# EAGLE design strobe_ds (EAGLE 6.3)
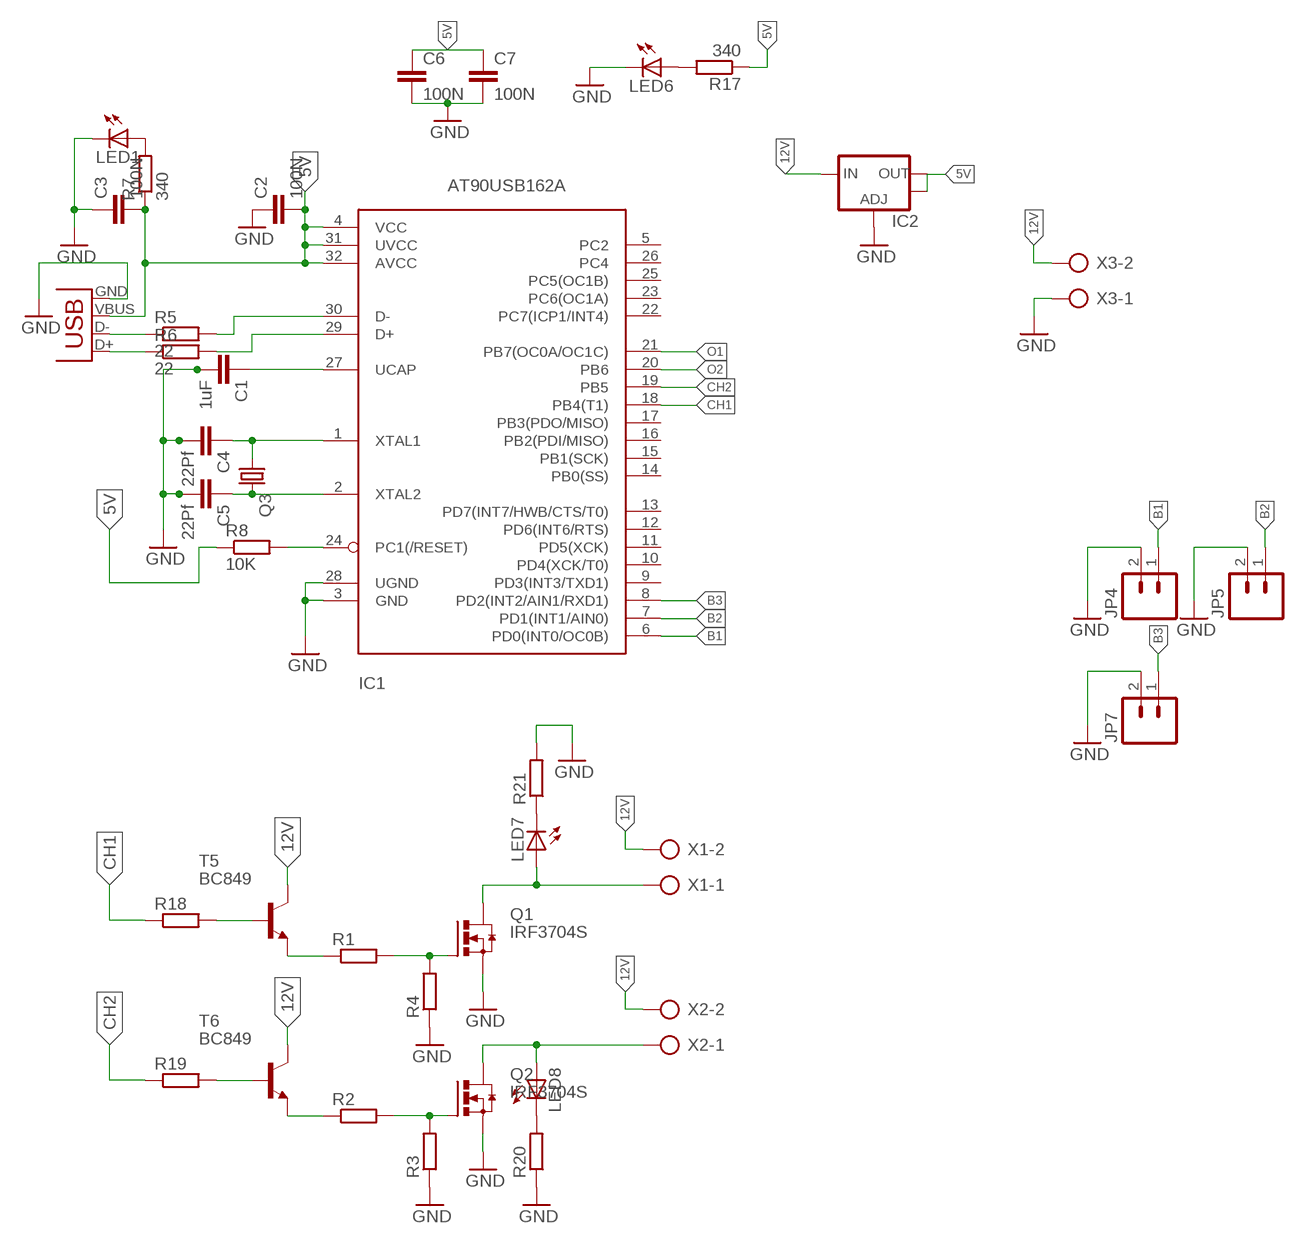
[diagram p0: schematic, sheet 1]

## Parts
C1  1uF  C-EUC0805  [C0805]
C2  100N  C-EUC0805  [C0805]
C3  100N  C-EUC0805  [C0805]
C4  22Pf  C-EUC0603  [C0603]
C5  22Pf  C-EUC0603  [C0603]
C6  100N  C-EUC0805  [C0805]
C7  100N  C-EUC0805  [C0805]
IC1  AT90USB162A  [TQFP32-08]
IC2  V_REG_LM1117SOT223  [SOT223]
JP1  USBSMD  [USB-MINIB]
JP4  M02PTH3  [1X02_LONGPADS]
JP5  M02PTH3  [1X02_LONGPADS]
JP7  M02PTH3  [1X02_LONGPADS]
LED1  LEDSML0805  [SML0805]
LED6  LEDSML0805  [SML0805]
LED7  LEDSML0805  [SML0805]
LED8  LEDSML0805  [SML0805]
Q1  IRF3704S  [D2PACK]
Q2  IRF3704S  [D2PACK]
Q3  CRYSTALSM49  [SM49]
R1  R-EU_R0805  [R0805]
R2  R-EU_R0805  [R0805]
R3  R-EU_R0805  [R0805]
R4  R-EU_R0805  [R0805]
R5  22  R-EU_R0805  [R0805]
R6  22  R-EU_R0805  [R0805]
R7  340  R-EU_R0805  [R0805]
R8  10K  R-EU_R0805  [R0805]
R17  340  R-EU_R0805  [R0805]
R18  R-EU_R0805  [R0805]
R19  R-EU_R0805  [R0805]
R20  R-EU_R0805  [R0805]
R21  R-EU_R0805  [R0805]
T5  BC849  [SOT23]
T6  BC849  [SOT23]
X1  AK300/2  [AK300/2]
X2  AK300/2  [AK300/2]
X3  AK300/2  [AK300/2]

## Nets
5V: C2.2 C3.2 C6.1 C7.1 IC1.4(VCC) IC1.31(UVCC) IC1.32(AVCC) IC2.2(OUT) IC2.4(OUT) JP1.VBUS R7.1 R8.1 R17.1
12V: IC2.3(IN) T5.3(C) T6.3(C) X1.2 X2.2 X3.2
B1: IC1.6(PD0(INT0/OC0B)) JP4.1
B2: IC1.7(PD1(INT1/AIN0)) JP5.1
B3: IC1.8(PD2(INT2/AIN1/RXD1)) JP7.1
CH1: IC1.18(PB4(T1)) R18.1
CH2: IC1.19(PB5) R19.1
GND: C1.2 C2.1 C3.1 C4.2 C5.2 C6.2 C7.2 IC1.3(GND) IC1.28(UGND) IC2.1(ADJ) JP1.GND JP4.2 JP5.2 JP7.2 LED1.C LED6.C Q1.3(S) Q2.3(S) R3.1 R4.1 R20.1 R21.2 X3.1
N$1: Q1.1(G) R1.2 R4.2
N$2: Q2.1(G) R2.2 R3.2
N$3: LED7.A Q1.2(D) X1.1
N$4: LED8.A Q2.2(D) X2.1
N$5: C1.1 IC1.27(UCAP)
N$6: JP1.D+ R6.1
N$7: JP1.D- R5.1
N$8: IC1.30(D-) R5.2
N$9: IC1.29(D+) R6.2
N$10: LED1.A R7.2
N$12: C5.1 IC1.2(XTAL2) Q3.2
N$13: C4.1 IC1.1(XTAL1) Q3.1
N$14: IC1.24(PC1(/RESET)) R8.2
N$27: LED6.A R17.2
N$28: R1.1 T5.2(E)
N$29: R2.1 T6.2(E)
N$30: R18.2 T5.1(B)
N$31: R19.2 T6.1(B)
N$32: LED8.C R20.2
N$33: LED7.C R21.1
O1: IC1.21(PB7(OC0A/OC1C))
O2: IC1.20(PB6)
Unconnected: IC1.5(PC2) IC1.9(PD3(INT3/TXD1)) IC1.10(PD4(XCK/T0)) IC1.11(PD5(XCK)) IC1.12(PD6(INT6/RTS)) IC1.13(PD7(INT7/HWB/CTS/T0)) IC1.14(PB0(SS)) IC1.15(PB1(SCK)) IC1.16(PB2(PDI/MISO)) IC1.17(PB3(PDO/MISO)) IC1.22(PC7(ICP1/INT4)) IC1.23(PC6(OC1A)) IC1.25(PC5(OC1B)) IC1.26(PC4)

## Library data of the parts
C1-C7 = rcl:C-EU: CAPACITOR, European symbol
IC1 = adafruit:AT90USB162: MICROCONTROLLER 8 Kbytes FLASH 1 kbytes SRAM 512 bytes EEPROM USART 6-channel 10 bit ADC 2-channel 8 bit ADC
IC2 = SparkFun-PowerIC:V_REG_LM1117: Voltage Regulator LM1117 Standard adjustable voltage regulator but in SMD form. Spark Fun Electronics SKU : COM-00595
JP1 = SparkFun-Connectors:USB: USB Connectors USB-B-PTH is fully proven SKU : PRT-00139/CONN-08278 USB-miniB is fully proven SKU : PRT-00587 USB-A-PCB is untested. USB-A-H is throughly reviewed, but untested. Spark Fun Electronics SKU : PRT-00437 USB-B-SMT is throughly reviewed, but untested. Needs silkscreen touching up. USB-A-S has not been used/tested USB-MB-H has not been used/tested USB-MICROB has been used. CONN-09505
JP4 JP5 JP7 = SparkFun-Connectors:M02: Header 2 Standard 2-pin 0.1" header. Use with straight break away headers (SKU : PRT-00116), right angle break away headers (PRT-00553), swiss pins (PRT-00743), machine pins (PRT-00117), and female headers (PRT-00115). Molex polarized connector foot print use with SKU : PRT-08233 with associated crimp pins and housings.
LED1 LED6-LED8 = led:LED: LED OSRAM: - CHIPLED LG R971, LG N971, LY N971, LG Q971, LY Q971, LO R971, LY R971 LH N974, LH R974 LS Q976, LO Q976, LY Q976 LO Q996 - Hyper CHIPLED LW Q18S LB Q993, LB Q99A, LB R99A - SideLED LS A670, LO A670, LY A670, LG A670, LP A670 LB A673, LV A673, LT A673, LW A673 LH A674 LY A675 LS A676, LA A676, LO A676, LY A676, LW A676 LS A679, LY A679, LG A679 - Hyper Micro SIDELED® LS Y876, LA Y876, LO Y876, LY Y876 LT Y87S - SmartLED LW L88C, LW L88S LB L89C, LB L89S, LG L890 LS L89K, LO L89K, LY L89K LS L896, LA L896, LO L896, LY L896 - TOPLED LS T670, LO T670, LY T670, LG T670, LP T670 LSG T670, LSP T670, LSY T670, LOP T670, LYG T670 LG T671, LOG T671, LSG T671 LB T673, LV T673, LT T673, LW T673 LH T674 LS T676, LA T676, LO T676, LY T676, LB T676, LH T676, LSB T676, LW T676 LB T67C, LV T67C, LT T67C, LS T67K, LO T67K, LY T67K, LW E67C LS E67B, LA E67B, LO E67B, LY E67B, LB E67C, LV E67C, LT E67C LW T67C LS T679, LY T679, LG T679 LS T770, LO T770, LY T770, LG T770, LP T770 LB T773, LV T773, LT T773, LW T773 LH T774 LS E675, LA E675, LY E675, LS T675 LS T776, LA T776, LO T776, LY T776, LB T776 LHGB T686 LT T68C, LB T68C - Hyper Mini TOPLED® LB M676 - Mini TOPLED Santana® LG M470 LS M47K, LO M47K, LY M47K Source: http://www.osram.convergy.de LUXEON: - LUMILED® LXK2-PW12-R00, LXK2-PW12-S00, LXK2-PW14-U00, LXK2-PW14-V00 LXK2-PM12-R00, LXK2-PM12-S00, LXK2-PM14-U00 LXK2-PE12-Q00, LXK2-PE12-R00, LXK2-PE12-S00, LXK2-PE14-T00, LXK2-PE14-U00 LXK2-PB12-K00, LXK2-PB12-L00, LXK2-PB12-M00, LXK2-PB14-N00, LXK2-PB14-P00, LXK2-PB14-Q00 LXK2-PR12-L00, LXK2-PR12-M00, LXK2-PR14-Q00, LXK2-PR14-R00 LXK2-PD12-Q00, LXK2-PD12-R00, LXK2-PD12-S00 LXK2-PH12-R00, LXK2-PH12-S00 LXK2-PL12-P00, LXK2-PL12-Q00, LXK2-PL12-R00 Source: www.luxeon.com KINGBRIGHT: KA-3528ASYC Source: www.kingbright.com
Q1 Q2 = transistor-power:IRF3704: SMPS MOSFET HEXFET® Power MOSFET Source: http://www.irf.com/product-info/datasheets/data/irf3704.pdf
Q3 = crystal:CRYSTAL: CRYSTAL; OC_FARNELL: unknown; OC_NEWARK: unknown
R1-R8 R17-R21 = rcl:R-EU_: RESISTOR, European symbol
T5 T6 = transistor:BC849: NPN TRANSISTOR
X1-X3 = con-ptr500:AK300/2: CONNECTOR; OC_FARNELL: unknown; OC_NEWARK: unknown

## Board
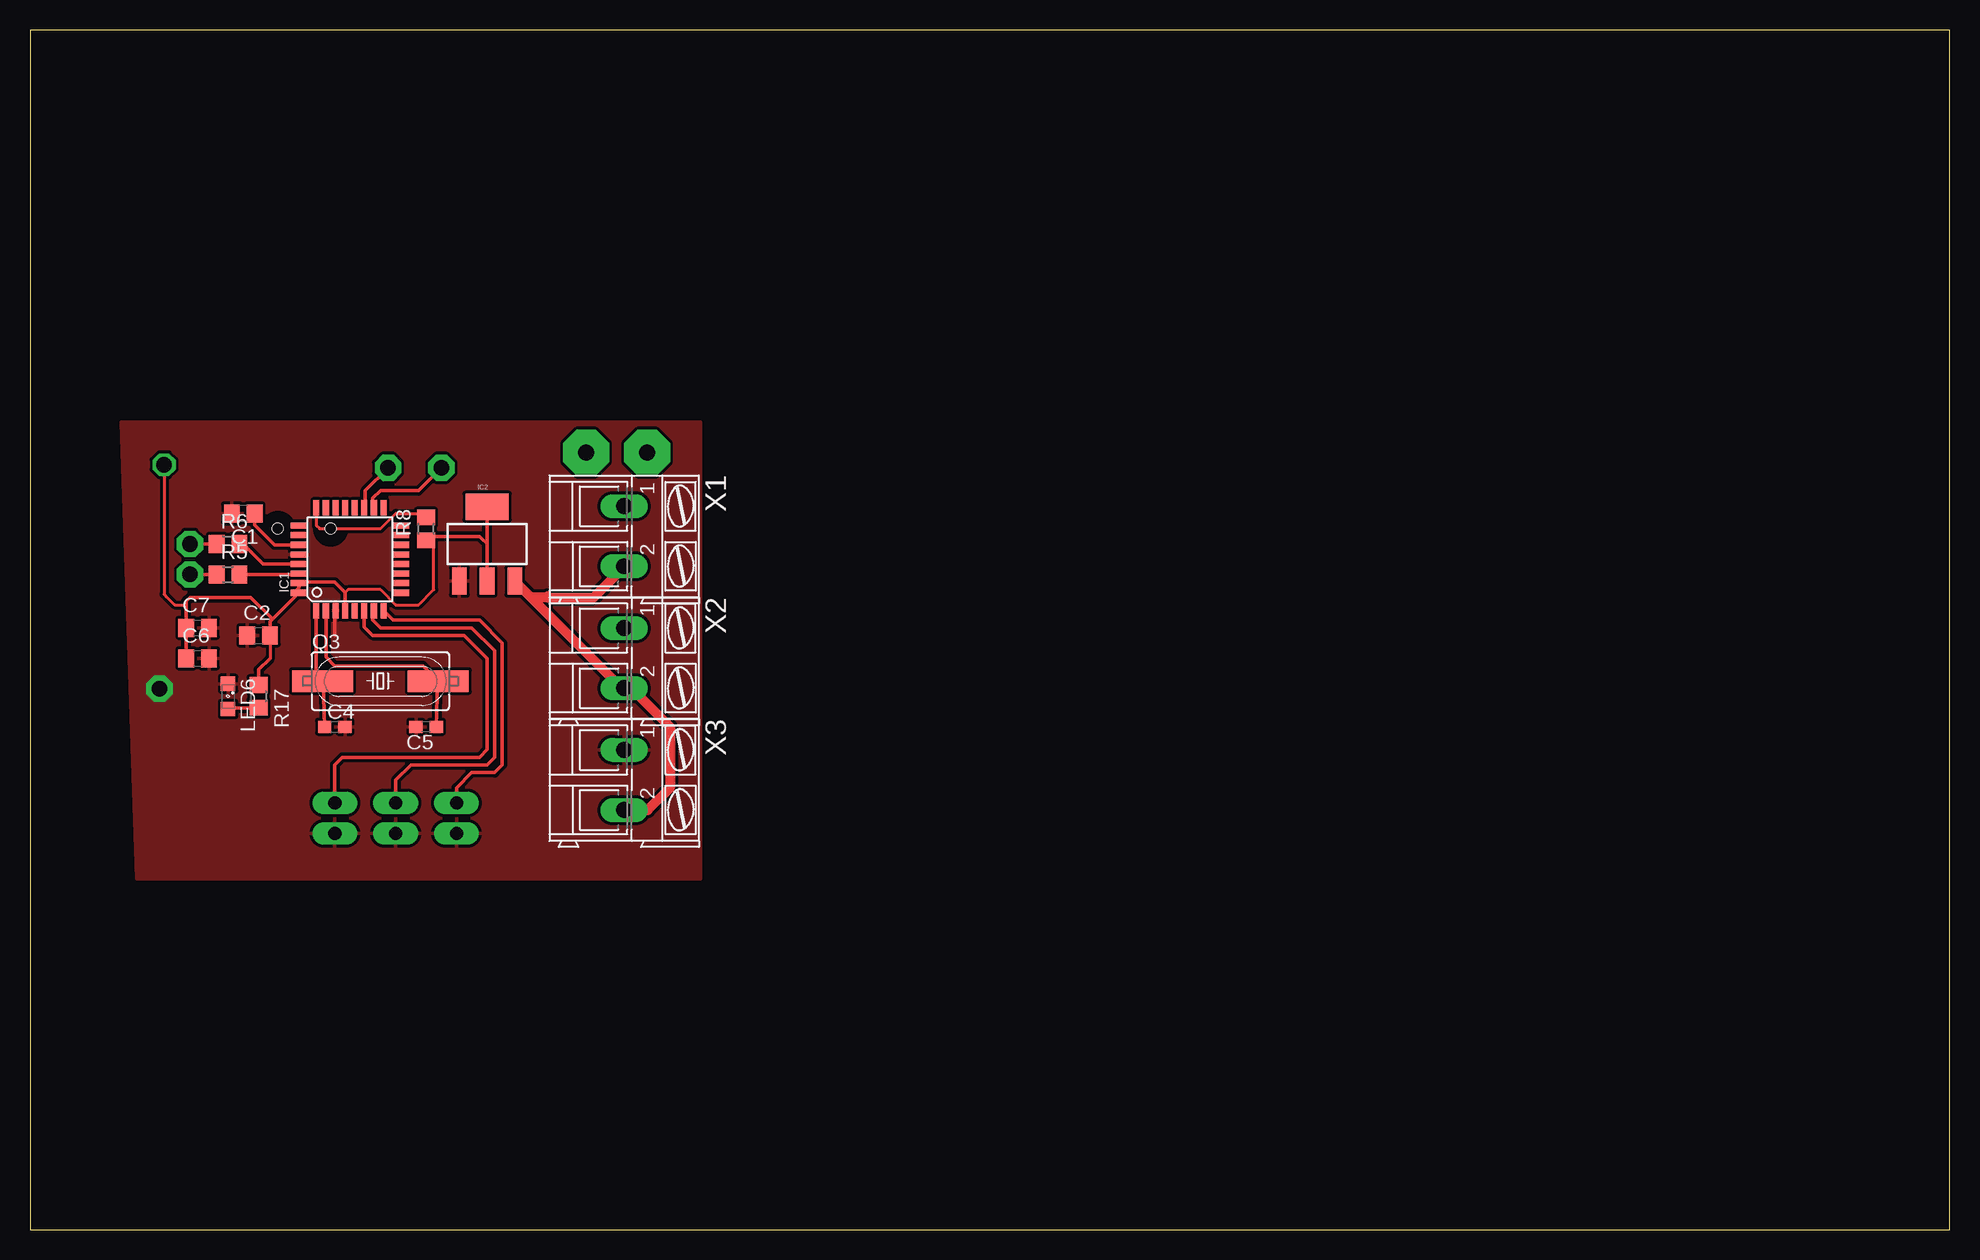
[diagram p1: board, top side]
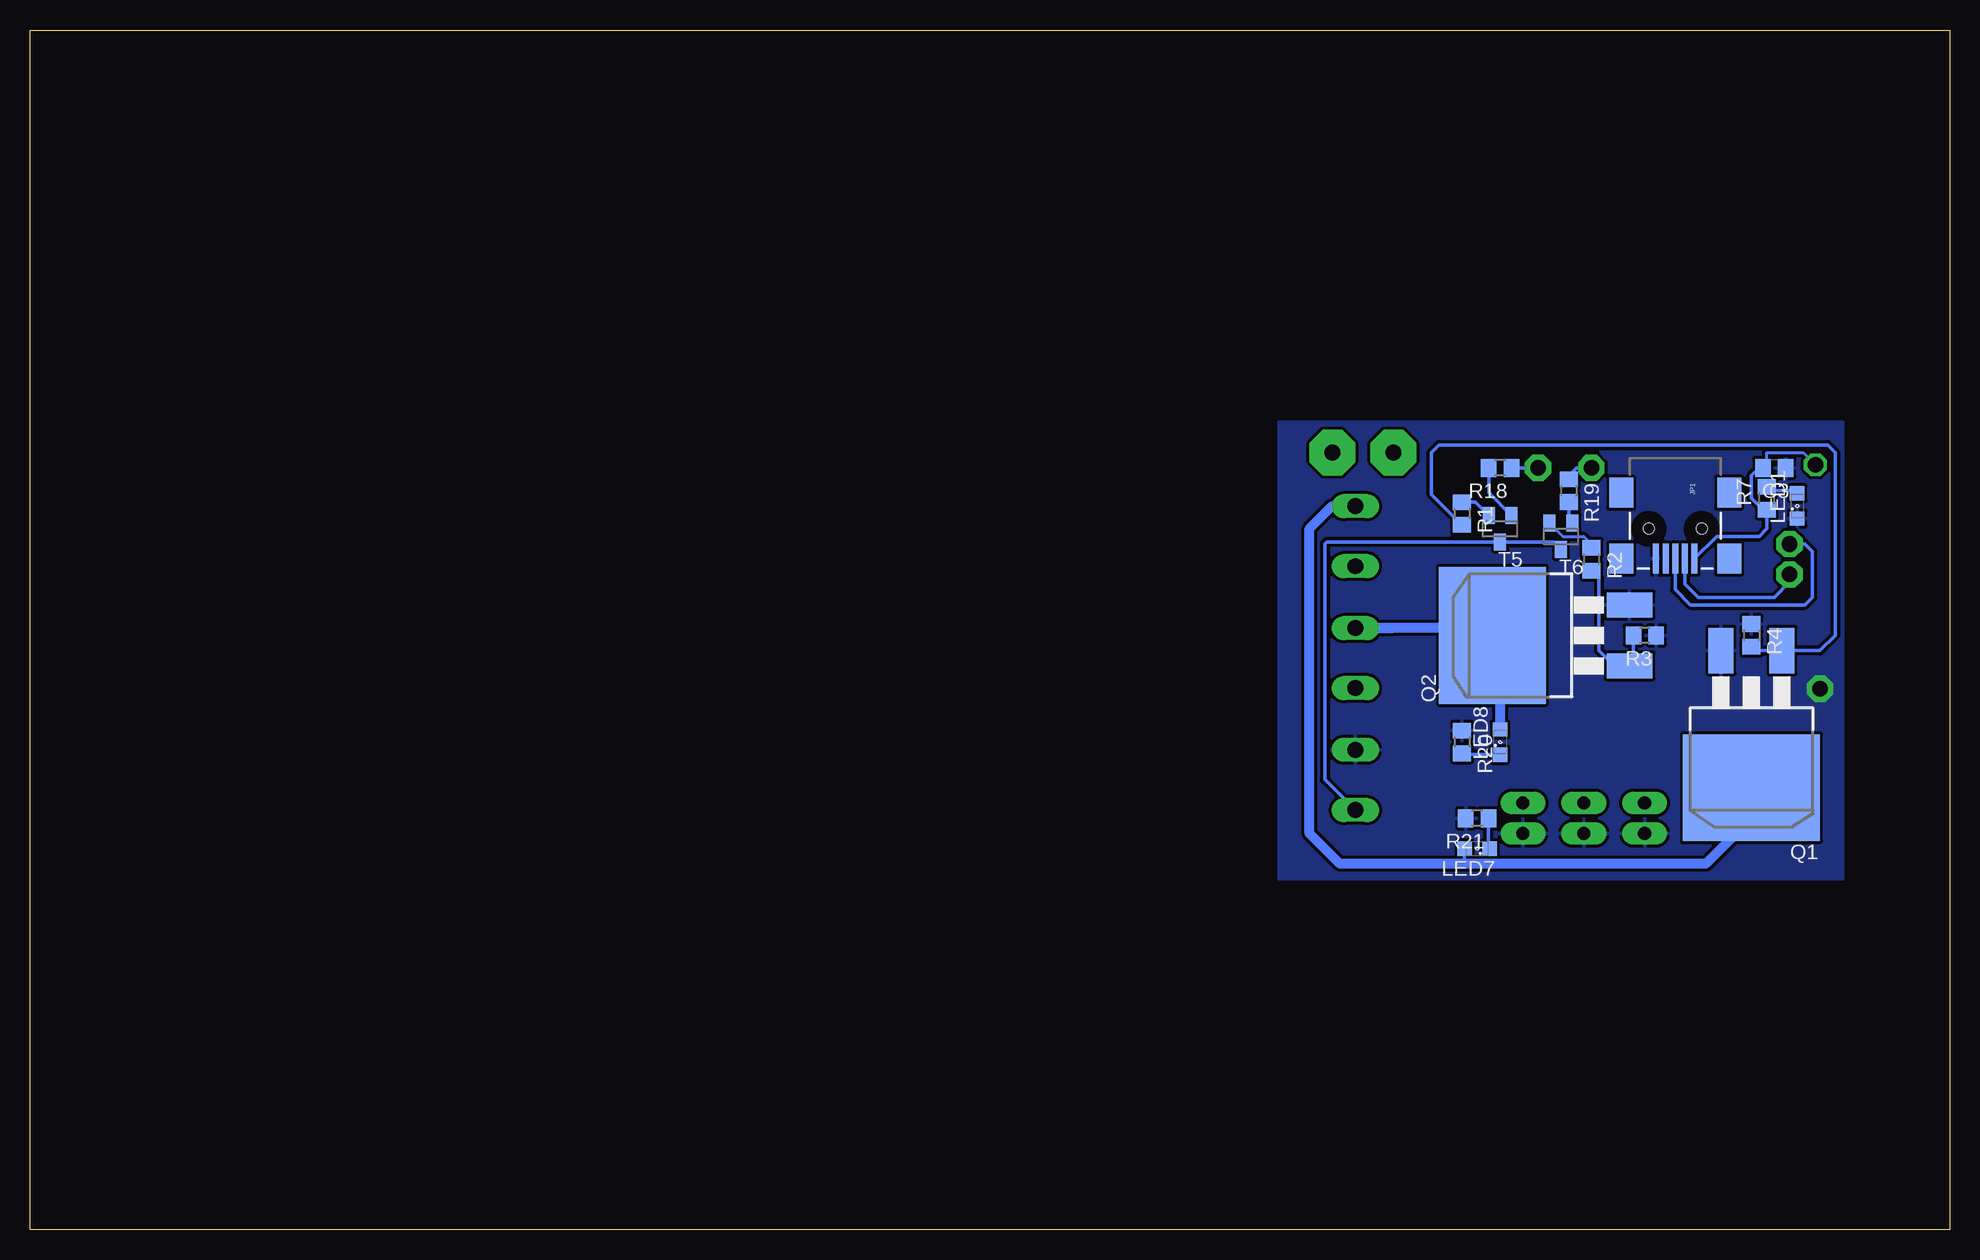
[diagram p2: board, bottom side, seen from below]

Size 160 x 100 mm. Coordinates in mm from the lower left corner, seen from the top.
Outline: 0,0 160,0 160,100 0,100 0,0
Copper layers (1*16): Top 0.035mm / dielectric 1.5mm / Bottom 0.035mm
Design rules "default": minimum track width 10mil, minimum drill 24mil, track to track 8mil, track to pad 8mil, pad to pad 8mil, via to via 8mil, smd to smd 8mil, copper to edge 40mil, drill to drill 8mil, minimum pad ring 10mil, minimum via ring 8mil, stop-mask expansion 4mil, vias tented up to drill 0mil, thermal gap 10mil

### Footprints (pad centres in the part's own frame; a part is rotated, then mirrored left to right if it is on the bottom)
C0805 = smd 1.3 x 1.5: 1 -0.95,0; 2 0.95,0
C0603 = smd 1.1 x 1: 1 -0.85,0; 2 0.85,0
TQFP32-08 = smd 1.27 x 0.508: 1 -4.293,2.8; 2 -4.293,2; 3 -4.293,1.2; 4 -4.293,0.4; 5 -4.293,-0.4; 6 -4.293,-1.2; 7 -4.293,-2; 8 -4.293,-2.8; 17 4.293,-2.8; 18 4.293,-2; 19 4.293,-1.2; 20 4.293,-0.4; 21 4.293,0.4; 22 4.293,1.2; 23 4.293,2; 24 4.293,2.8 | smd 0.508 x 1.27: 9 -2.8,-4.293; 10 -2,-4.293; 11 -1.2,-4.293; 12 -0.4,-4.293; 13 0.4,-4.293; 14 1.2,-4.293; 15 2,-4.293; 16 2.8,-4.293; 25 2.8,4.293; 26 2,4.293; 27 1.2,4.293; 28 0.4,4.293; 29 -0.4,4.293; 30 -1.2,4.293; 31 -2,4.293; 32 -2.8,4.293
SOT223 = smd 1.219 x 2.235: 1 -2.311,-3.099; 2 0,-3.099; 3 2.311,-3.099 | smd 3.6 x 2.2: 4 0,3.099
USB-MINIB = smd 2.5 x 0.5: D+ 2.5,0; D- 2.5,0.8; GND 2.5,-1.6; ID 2.5,-0.8; VBUS 2.5,1.6 | smd 2.5 x 2: MTN1 -3,4.5; MTN2 2.5,4.5; MTN3 -3,-4.5; MTN4 2.5,-4.5 | hole 0.9: 0,2.2; 0,-2.2
1X02_LONGPADS = drill 1.118 pad 1.88 long: 1 0,0; 2 2.54,0
SML0805 = smd 1.2 x 1.2: A 1.05,0; C -1.05,0
D2PACK = smd 2.083 x 3.81: 1 -2.54,-8.89; 3 2.54,-8.89 | smd 11.43 x 8.89: 2 0,2.54
SM49 = smd 5.08 x 1.778: 1 -4.826,0; 2 4.826,0
R0805 = smd 1.3 x 1.5: 1 -0.95,0; 2 0.95,0
SOT23 = smd 1 x 1.4: 1 -0.95,-1.1; 2 0.95,-1.1; 3 0,1.1
AK300/2 = drill 1.321 long: 1 -2.515,0; 2 2.489,0

### Placement (x,y rotation side)
C1  17.78,59.69 180 top
C2  19.05,49.53 0 top
C3  14.61,63.5 180 bottom
C4  25.4,41.91 0 top
C5  33.02,41.91 180 top
C6  13.97,47.62 0 top
C7  13.97,50.16 0 top
IC1  26.67,55.88 90 top
IC2  38.1,57.15 0 top
JP1  22.86,58.42 270 bottom
JP4  25.4,35.56 270 top
JP5  30.48,35.56 270 top
JP7  35.56,35.56 270 top
LED1  12.7,60.33 90 bottom
LED6  16.51,44.45 270 top
LED7  39.37,31.75 180 bottom
LED8  37.47,40.64 90 bottom
Q1  16.51,39.37 180 bottom
Q2  35.56,49.53 90 bottom
Q3  29.21,45.72 0 top
R1  40.64,59.69 270 bottom
R2  29.84,55.88 270 bottom
R3  25.4,49.53 180 bottom
R4  16.51,49.53 270 bottom
R5  16.51,54.61 0 top
R6  16.51,57.15 0 top
R7  15.24,60.96 90 bottom
R8  33.02,58.42 90 top
R17  19.05,44.45 270 top
R18  37.47,63.5 180 bottom
R19  31.75,61.59 270 bottom
R20  40.64,40.64 270 bottom
R21  39.37,34.29 180 bottom
T5  37.47,58.42 180 bottom
T6  32.38,57.78 180 bottom
X1  49.53,57.78 270 top
X2  49.53,47.62 270 top
X3  49.53,37.47 270 top

### Tracks (layer width: path | path; a pad name or v marks a point on that pad's centre or on a via)
5V  (via drill 1.27)
  Top 0.254: R8.1 33.66,57.47 33.66,53.34 32.38,52.07 30.48,52.07 29.21,53.34 26.5,53.34 26.27,53.1 | 37.78,57.47 38.1,57.15 | C2.2 20,47.62 | 22.47,53.98 22.47,53.59 22.23,53.34 | 13.02,52.07 12.06,52.07 11.62,52.51 11.43,52.7 11.18,52.96 v11.18,63.75
  Top 0.305: IC2.2 38.1,57.15 IC2.4 | IC1.4 26.27,53.1 25.4,53.98 22.47,53.98 IC1.31 IC1.32 20.21,50.91 | 20.21,50.91 20,50.7 C2.2 | C6.1 C7.1 13.02,52.07 13.02,52.39 13.34,52.7 18.41,52.7 20.21,50.91 | 37.78,57.47 37.47,57.78 33.02,57.78 R8.1 | 20,47.62 19.05,46.67 R17.1
  Bottom 0.254: C3.2 15.24,63.5 15.24,64.77 12.19,64.77 v11.18,63.75
  Bottom 0.305: JP1.VBUS 19.39,57.78 15.88,57.78 15.24,58.42 15.24,59.69 | R7.1 15.24,59.69 | 15.24,59.69 16.51,60.96 16.51,62.87 15.88,63.5 C3.2
12V
  Top 0.813: X3.2 51.49,34.98 53.34,36.83 53.34,41.91 50.11,45.14 X2.2 49.33,45.14 41.76,52.7 | IC2.3 41.76,52.7 | 43.1,52.7 46.99,52.7 49.53,55.24 X1.2 | 43.18,52.78 43.1,52.7 | 43.1,52.7 41.76,52.7
  Bottom 0.305: X3.2 52.07,37.52 52.07,57.15 51.9,57.32 T5.3 33.02,57.32 T6.3
  Bottom 0.813: X1.2 49.48,55.24
B1
  Top 0.305: IC1.6 27.87,50.23 28.57,49.53 36.2,49.53 38.1,47.62 38.1,40.01 37.47,39.37 26.04,39.37 25.4,38.73 JP4.1
B2
  Top 0.305: IC1.7 28.57,51.49 28.57,50.8 29.21,50.16 36.83,50.16 38.73,48.26 38.73,39.37 38.1,38.73 31.75,38.73 30.48,37.47 JP5.1
B3
  Top 0.305: IC1.8 30.26,50.8 37.47,50.8 39.37,48.9 39.37,38.73 38.73,38.1 36.83,38.1 35.56,36.83 JP7.1
CH1  (via drill 1.3 pad 2.18)
  Top 0.305: IC1.18 28.57,60.27 28.57,60.96 29.21,61.59 32.38,61.59 v34.29,63.5
  Bottom 0.305: v34.29,63.5 R18.1
CH2  (via drill 1.3 pad 2.18)
  Top 0.305: IC1.19 27.94,60.24 27.94,61.59 v29.84,63.5
  Bottom 0.305: v29.84,63.5 31.11,63.5 31.75,62.87 R19.1
GND  (via drill 1.3 pad 2.18)
  Top 0.305: IC1.3 25.4,51.59 25.4,49.53
  Bottom 0.305: 19.37,48.26 Q1.3
  other vias: 10.79,45.09
  pour Bottom (isolate 0.254): 8.89,67.31 8.89,29.21 55.88,29.21 55.88,67.31
  pour Top (isolate 0.254): 7.62,67.31 55.88,67.31 55.88,29.21 8.89,29.21
N$1
  Bottom 0.305: Q1.1 13.97,46.99 | R1.2 43.18,61.28 43.18,64.77 42.55,65.41 10.16,65.41 9.53,64.77 9.53,49.53 10.79,48.26 Q1.1 | R4.2 16.19,48.26 Q1.1
N$2
  Bottom 0.305: R2.2 29.21,54.3 29.21,48.26 27.94,46.99 Q2.1 26.35,47.31 R3.2
N$3
  Bottom 0.305: 15.46,37.88 arc-90 Q1.2 | LED7.A 40.42,30.7 40.64,30.48
  Bottom 0.813: 15.46,37.88 15.46,38.32 | 15.46,38.32 16.51,39.37 17.78,38.1 17.78,33.02 20.32,30.48 40.64,30.48 50.8,30.48 53.34,33.02 53.34,58.42 51.46,60.3 X1.1 49.51,60.33 | 11.43,34.29 15.46,38.32
N$4
  Bottom 0.813: 46.35,50.16 49.51,50.16 X2.1 38.71,50.14 Q2.2 37.47,48.9 LED8.A
N$5
  Top 0.305: IC1.27 20.39,57.08 18.73,58.74 C1.1
N$6  (via drill 1.3 pad 2.18)
  Top 0.305: v13.34,57.15 R6.1
  Bottom 0.305: JP1.D+ 22.86,53.34 21.59,52.07 12.06,52.07 11.43,52.7 11.43,56.52 12.06,57.15 v13.34,57.15
N$7  (via drill 1.3 pad 2.18)
  Top 0.305: v13.34,54.61 R5.1
  Bottom 0.305: JP1.D- 22.06,53.81 20.95,52.7 14.61,52.7 13.34,53.98 v13.34,54.61
N$8
  Top 0.305: IC1.30 22.31,54.61 R5.2
N$9
  Top 0.305: IC1.29 19.45,55.48 17.78,57.15 R6.2
N$10
  Bottom 0.305: R7.2 14.93,61.59 12.92,61.59 LED1.A
N$12
  Top 0.305: IC1.2 24.67,47.72 25.4,46.99 32.77,46.99 Q3.2 33.97,45.65 C5.1
N$13
  Top 0.305: IC1.1 23.87,46.23 Q3.1 24.45,45.65 C4.1
N$14
  Top 0.254: IC1.24 23.87,58.68 24.13,58.42 29.21,58.42 30.48,59.69 32.7,59.69 R8.2
N$15  (via drill 1.3 pad 3.81)
  other vias: 46.35,64.77
N$16  (via drill 1.3 pad 3.81)
  other vias: 51.44,64.77
N$27
  Top 0.305: LED6.A 16.61,43.5 R17.2
N$28
  Bottom 0.305: T5.2 39.53,60.64 R1.1
N$29
  Bottom 0.254: T6.2 32.23,57.78 30.48,57.78 29.84,57.15 R2.1
N$30
  Bottom 0.305: R18.2 38.41,61.42 T5.1
N$31
  Bottom 0.305: R19.2 31.75,59.2 T6.1
N$32
  Bottom 0.305: LED8.C 40.54,39.59 R20.2
N$33
  Bottom 0.305: LED7.C 38.42,31.85 R21.1